# Altium schematic sheet APD_Design.SchDoc
size A4
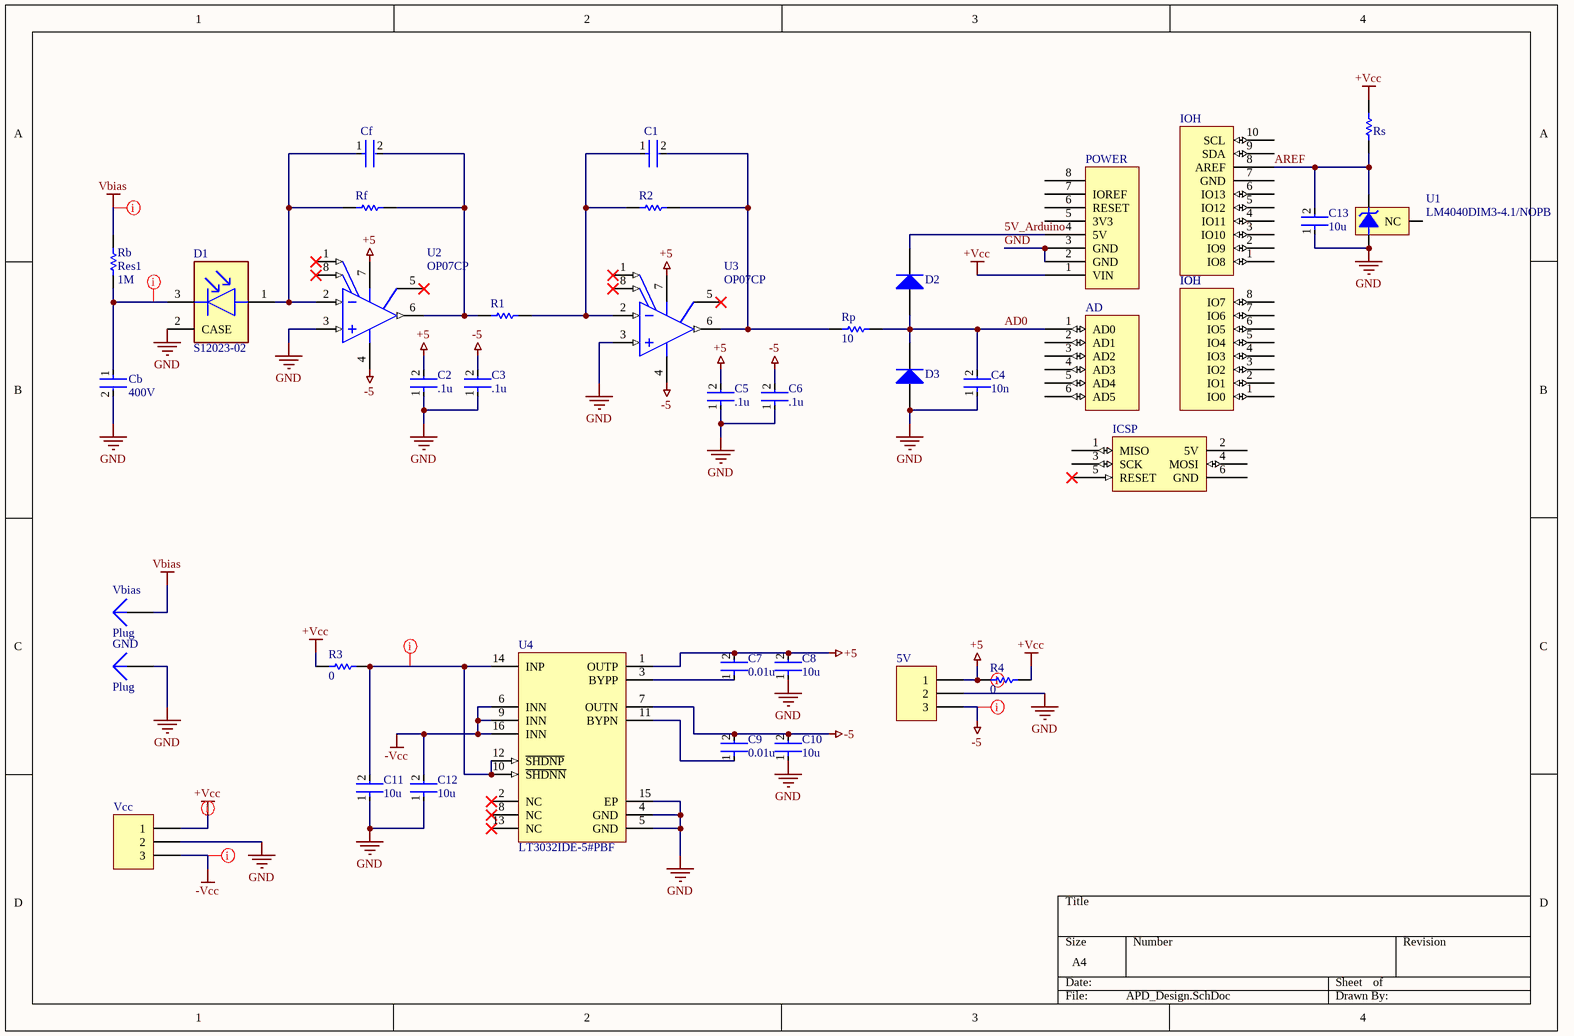
[diagram p0: APD_Design.SchDoc]

## Parts
5V  5V  [HDR1X3]  (value not drawn)
AD  AD  [Header 6x1 8.5mm]  (value not drawn)
C1  (no value)  [FP-C0805C-DG-MFG]
C2  .1u  [FP-C0805C-DG-MFG]
C3  .1u  [FP-C0805C-DG-MFG]
C4  10n  [FP-C0805C-DG-MFG]
C5  .1u  [FP-C0805C-DG-MFG]
C6  .1u  [FP-C0805C-DG-MFG]
C7  0.01u  [FP-C0805C-DG-MFG]
C8  10u  [FP-C0805C-DG-MFG]
C9  0.01u  [FP-C0805C-DG-MFG]
C10  10u  [FP-C0805C-DG-MFG]
C11  10u  [FP-C0805C-DG-MFG]
C12  10u  [FP-C0805C-DG-MFG]
C13  10u  [FP-C0805C-DG-MFG]
Cb  400V  [FP-VY1472M63Y5UQ6TV0-MFG]
Cf  (no value)  [FP-C0805C-DG-MFG]
D1  S12023-02  [FP-S12023-02-MFG]
D2  Diode 1N4148  [DO-35]  (value not drawn)
D3  Diode 1N4148  [DO-35]  (value not drawn)
GND  Plug  [PIN1]
ICSP  ICSP  [ICSP]  (value not drawn)
IOH  IOH  [Header 10x1 8.5mm]
IOL  IOL  [Header 8x1 8.5mm]  (value not drawn)
POWER  POWER_UNO  [Header 8x1 8.5mm]  (value not drawn)
R1  CRCW08050000Z0EA  [RESC2013X50X30LL20T20]  (value not drawn)
R2  CRCW08050000Z0EA  [RESC2013X50X30LL20T20]  (value not drawn)
R3  0  [RESC2013X50X30LL20T20]
R4  0  [RESC2013X50X30LL20T20]
Rb  Res1  value 1M  [AXIAL-0.3]
Rf  (no value)  [RESC2013X50X30LL20T20]
Rp  10  [RESC2013X50X30LL20T20]
Rs  CRCW08050000Z0EA  [RESC2013X50X30LL20T20]  (value not drawn)
U1  LM4040DIM3-4.1/NOPB  [MF03A_N]
U2  OP07CP  [P0008A]
U3  OP07CP  [P0008A]
U4  LT3032IDE-5#PBF  [LT-DE14MA-14_V]
Vbias  Plug  [PIN1]
Vcc  Vcc  [HDR1X3]  (value not drawn)

## Nets
+5: 5V.1 C2.2 C5.2 C7.2 C8.2 R4.1 U2.7(VCC+) U3.7(VCC+) U4.1(OUTP)
+Vcc: POWER.1(VIN) R3.1 R4.2 Rs.2 Vcc.1
-5: 5V.3 C3.2 C6.2 C9.2 C10.2 U2.4(VCC-) U3.4(VCC-) U4.7(OUTN)
-Vcc: C12.2 U4.6(INN) U4.9(INN) U4.16(INN) Vcc.3
GND: 5V.2 C2.1 C3.1 C4.1 C5.1 C6.1 C8.1 C10.1 C11.1 C12.1 C13.1 Cb.2 D1.2(CASE) D3.1(A) GND.1 POWER.2(GND) POWER.3(GND) U1.2(-V) U2.3(IN+) U3.3(IN+) U4.4(GND) U4.5(GND) U4.15(EP) Vcc.2
Vbias: Rb.2 Vbias.1
5V_Arduino: D2.2(K) POWER.4(5V)
AD0: AD.1(AD0) C4.2 D2.1(A) D3.2(K) Rp.2
AREF: C13.2 IOH.8(AREF) Rs.1 U1.1(+V)
NetC1_1: C1.1 R1.2 R2.1 U3.2(IN-)
NetC1_2: C1.2 R2.2 Rp.1 U3.6(OUT)
NetC7_1: C7.1 U4.3(BYPP)
NetC9_1: C9.1 U4.11(BYPN)
NetC11_2: C11.2 R3.2 U4.10(~{SHDNN}) U4.12(~{SHDNP}) U4.14(INP)
NetCb_1: Cb.1 D1.3(C) Rb.1
NetCf_1: Cf.1 D1.1(A) Rf.1 U2.2(IN-)
NetCf_2: Cf.2 R1.1 Rf.2 U2.6(OUT)

Not connected (* = marked no-connect by the designer): AD 2(AD1) 3(AD2) 4(AD3) 5(AD4) 6(AD5); ICSP 1(MISO) 2(5V) 3(SCK) 4(MOSI) 5(RESET)* 6(GND); IOH 1(IO8) 2(IO9) 3(IO10) 4(IO11) 5(IO12) 6(IO13) 7(GND) 9(SDA) 10(SCL); IOL 1(IO0) 2(IO1) 3(IO2) 4(IO3) 5(IO4) 6(IO5) 7(IO6) 8(IO7); POWER 5(3V3) 6(RESET) 7(IOREF) 8; U1 3(NC); U2 1(OFFSET_N1)* 5(NC)* 8(OFFSET_N2)*; U3 1(OFFSET_N1)* 5(NC)* 8(OFFSET_N2)*; U4 2(NC)* 8(NC)* 13(NC)*

## Layout directives
net class HV: NetCb_1, Vbias
net class Power: +5, +Vcc, -5, -Vcc, NetC11_2

## Library data of the parts
5V Vcc = Header 3: Header, 3-Pin; LatestRevisionDate: 17-Jul-2002; LatestRevisionNote: Re-released for DXP Platform.; Publisher: Altium Limited
C1-C13 = CMP-2007-03243-2: CAP CER 10UF 10V X5R 0805; Manufacturer Part Number: C0805C106K8PACTU; Manufacturer: Kemet; 3DS Part Number: 220-00001; Tolerance: 10%; Temperature Coefficient: 15%; Material: Ceramic; Device Class L2: Capacitors; Device Class L1: Passive Components; ComponentLink2URL: https://content.kemet.com/datasheets/KEM_C1006_X5R_SMD.pdf; Height: 1.4mm; Lead Free: Yes; Digikey Description: CAP CER 10UF 10V X5R 0805; Octopart: https://octopart.com/c0805c106k8pactu-kemet-98697; Capacitance: 10uF; Value: 10uF; Temperature Range Low: -55°C; Temperature: -55°C to +85°C; Automotive: No; Mouser Description: CAP CER 10UF 10V X5R 0805; Ipc Land Pattern Name: CAPC200125X125; Temperature Range High: +85°C; Voltage: 10V; RoHS: TRUE; Device Class L3: Ceramic Capacitors; ComponentLink2Description: Datasheet; Voltage Rating: 10V; Package: C0805C-DG; Temperature Characteristic: X5R; Category: Cap
Cb = CMP-02417-000050-1: CAP CER 4700PF 760VAC Y5U RADIAL; Voltage Rating (AC): 500V; Lead Diameter: 0.6mm; Capacitance: 4.7nF; Tolerance: 20%; Lead/Base Style: Kinked; Termination: Radial; Resistor Type: Ceramic; Radiation Hardening: No; Diameter: 16mm; Max Operating Temperature: 125°C; Case/Package: Radial; Thickness: 5mm; Lead Pitch: 10mm; Series: VY1; Contact Plating: Tin; Depth: 5mm; RoHS Compliant: Yes; Voltage: 500V; Voltage Rating (DC): 500V; Package Quantity: 500; Construction: RADIAL; Min Operating Temperature: -40°C; Height: 19mm; Height - Seated (Max): 0.787inch; Packaging: Tape and Reel; Dielectric: Y5U; Mount: Through Hole
Cf = CMP-2007-03243-2: CAP CER 10UF 10V X5R 0805; Manufacturer Part Number: C0805C106K8PACTU; Manufacturer: Kemet; 3DS Part Number: 220-00001; Tolerance: 10%; Temperature Coefficient: 15%; Device Class L2: Capacitors; Device Class L1: Passive Components; ComponentLink2URL: https://content.kemet.com/datasheets/KEM_C1006_X5R_SMD.pdf; Height: 1.4mm; Lead Free: Yes; Digikey Description: CAP CER 10UF 10V X5R 0805; Octopart: https://octopart.com/c0805c106k8pactu-kemet-98697; Capacitance: 10uF; Value: 10uF; Temperature Range Low: -55°C; Temperature: -55°C to +85°C; Automotive: No; Mouser Description: CAP CER 10UF 10V X5R 0805; Ipc Land Pattern Name: CAPC200125X125; Material: Ceramic; Temperature Range High: +85°C; Voltage: 10V; RoHS: TRUE; Device Class L3: Ceramic Capacitors; ComponentLink2Description: Datasheet; Voltage Rating: 10V; Package: C0805C-DG; Temperature Characteristic: X5R; Category: Cap
D1 = CMP-218204-000005-1: IR-photodiode Package: TO-18 Wavelength of max. photosensitivity: 800 nm; RoHS Compliant: Yes
D2 D3 = Diode 1N4148: High Conductance Fast Diode; Published: 8-Jun-2000; LatestRevisionDate: 17-Jul-2002; LatestRevisionNote: Re-released for DXP Platform.; DatasheetVersion: 1997; PackageReference: DO-35; Publisher: Altium Limited; PackageDescription: Diode, Axial; Body 3.8 x 1.9 mm (LxDia. max), Lead Dia. 0.53 mm (max); Code_JEDEC: DO-204-AH; ComponentLink1Description: Manufacturer Link; ComponentLink1URL: http://www.fairchildsemi.com/; ComponentLink2Description: Datasheet; ComponentLink2URL: http://www.fairchildsemi.com/ds/1N%2F1N4148.pdf
R1 R2 Rs = CMP-2001-04896-1: Manufacturer: Vishay Dale; Part Number: CRCW08050000Z0EA
R3 R4 Rf Rp = CMP-2001-04896-1: Manufacturer: Vishay Dale; Part Number: CRCW08050000Z0EA
Rb = Res1: Resistor; Published: 8-Jun-2000; LatestRevisionDate: 17-Jul-2002; LatestRevisionNote: Re-released for DXP Platform.; PackageReference: AXIAL-0.3; Publisher: Altium Limited; PackageDescription: Axial Device, Thru-Hole; 2 Leads; 0.3 in Pin Spacing
U1 = CMP-0074-00604-2: Precision Micropower Shunt Voltage Reference, 3-pin SOT-23, Pb-Free; Manufacturer: National Semiconductor; PackageTopMarking: R4D*XTT; PowerWise: N; CompType: Voltage Reference IC; PinCount: 3; PackageDescription: Molded SOT-23, .115 x .051 x .037in Body, 3 Lead, .075 in Pitch; ComponentLink2Description: LM4040 Web Page; ComponentLink2URL: http://www.national.com/pf/LM/LM4040.html; RevisionNote: Component URLs added; ComponentLink1URL: http://www.national.com/ds/LM/LM4040.pdf; DatasheetVersion: Apr-2005; PackageReference: MF03A; PackageVersion: revB, Mar-2003; RoHS: Y; ComponentLink3URL: http://www.national.com/packaging/folders/mf03a.html; ComponentLink3Description: MF03A Package Page; ComponentLink1Description: LM4040 Datasheet
U2 U3 = CMP-0017-00916-2: Low-Offset Voltage Operational Amplifier, 6 to 36 V, 0 to 70 degC, 8-pin DIP (P8), Pb-Free (RoHS); Manufacturer: Texas Instruments; Rating: Catalog; Iq per channel(Max)(mA): 5; GBW(Typ)(MHz): 0.6; Vn at 1kHz(Typ)(nV/rtHz): 9.8; Number of Channels: 1; Total Supply Voltage(Min)(+5V is 5, +/-5V is 10): 6; Vio (25C)(Max)(mV): 0.15; Slew Rate(Typ)(V/us): 0.3; Sub Family: General Purpose Amplifier, High Supply Voltage Amplifier (>=30V), Low Noise Amp (<=10nV/rtHz), Low Offset Voltage Amplifier (<=500uV); IIB(Max)(pA): 7000; Total Supply Voltage(Max)(+5V is 5, +/-5V is 10): 36; Offset Drift(Typ)(uV/C): 0.5; CMRR(Min)(dB): 100; Code_JEDEC: MS-001; ComponentLink1URL: http://www.ti.com/; ComponentLink2URL: http://www.ti.com/lit/ds/symlink/op07c.pdf; ComponentLink3Description: Package Specification; DatasheetVersion: SLOS099E; ComponentLink2Description: Datasheet; Eco-Plan: Pb-Free (RoHS); Mounting Technology: Through Hole; PackageReference: P0008A; PartNumber: OP07CP; ComponentLink3URL: http://www.ti.com/litv/pdf/mpdi001b; PackageVersion: 4040082/E, 04/2010; ComponentLink1Description: Manufacturer URL; PackageDescription: 8-Pin Plastic In-Line, Body 9.59 x 6.35 mm, Pitch 2.54 mm
U4 = CMP-0476-00362-1: Dual 150 mA Positive / Negative Low Noise Low Dropout Linear Regulator, +/-2.3 to +/-20 V Vin, +/-5 V Vout, 14-pin SON (DE14MA-14), -40 to 125 degC, Pb-Free; Manufacturer: Linear Technology; Dropout Voltage(V): 0.3; Noise(uV): 30; Isupply(mA): 0.025; PSRR(dB): 68; Iout(mA): 150; Output Voltage: +/-5V; Discrete Pass Element: no; Shutdown Current(uA): 0.1; Number of Outputs: 2; Mounting Technology: Surface Mount; ComponentLink1URL: http://www.linear.com/; PackageVersion: Rev. A, 06/2010; ComponentLink1Description: Manufacturer URL; Vout Min(V): +/-5; PackageDescription: 14-Pin Plastic DFN, Body 4 x 3 mm, Pitch 0.5 mm; DatasheetVersion: Rev. D; Vin Max(V): +/-20; ComponentLink3Description: Package Specification; PackageReference: DE14MA-14; ComponentLink3URL: http://cds.linear.com/docs/en/packaging/DFN_14_05-08-1731.pdf; ComponentLink2Description: Datasheet; Vin Min(V): +/-2.3; Vout Max(V): +/-5; ComponentLink2URL: http://cds.linear.com/docs/en/datasheet/3032fd.pdf; RoHS: TRUE; PartNumber: LT3032IDE-5#PBF
GND Vbias = Plug: LatestRevisionDate: 17-Jul-2002; LatestRevisionNote: Re-released for DXP Platform.; Publisher: Altium Limited